# EAGLE design usteps_v4 (EAGLE 9.0.0)
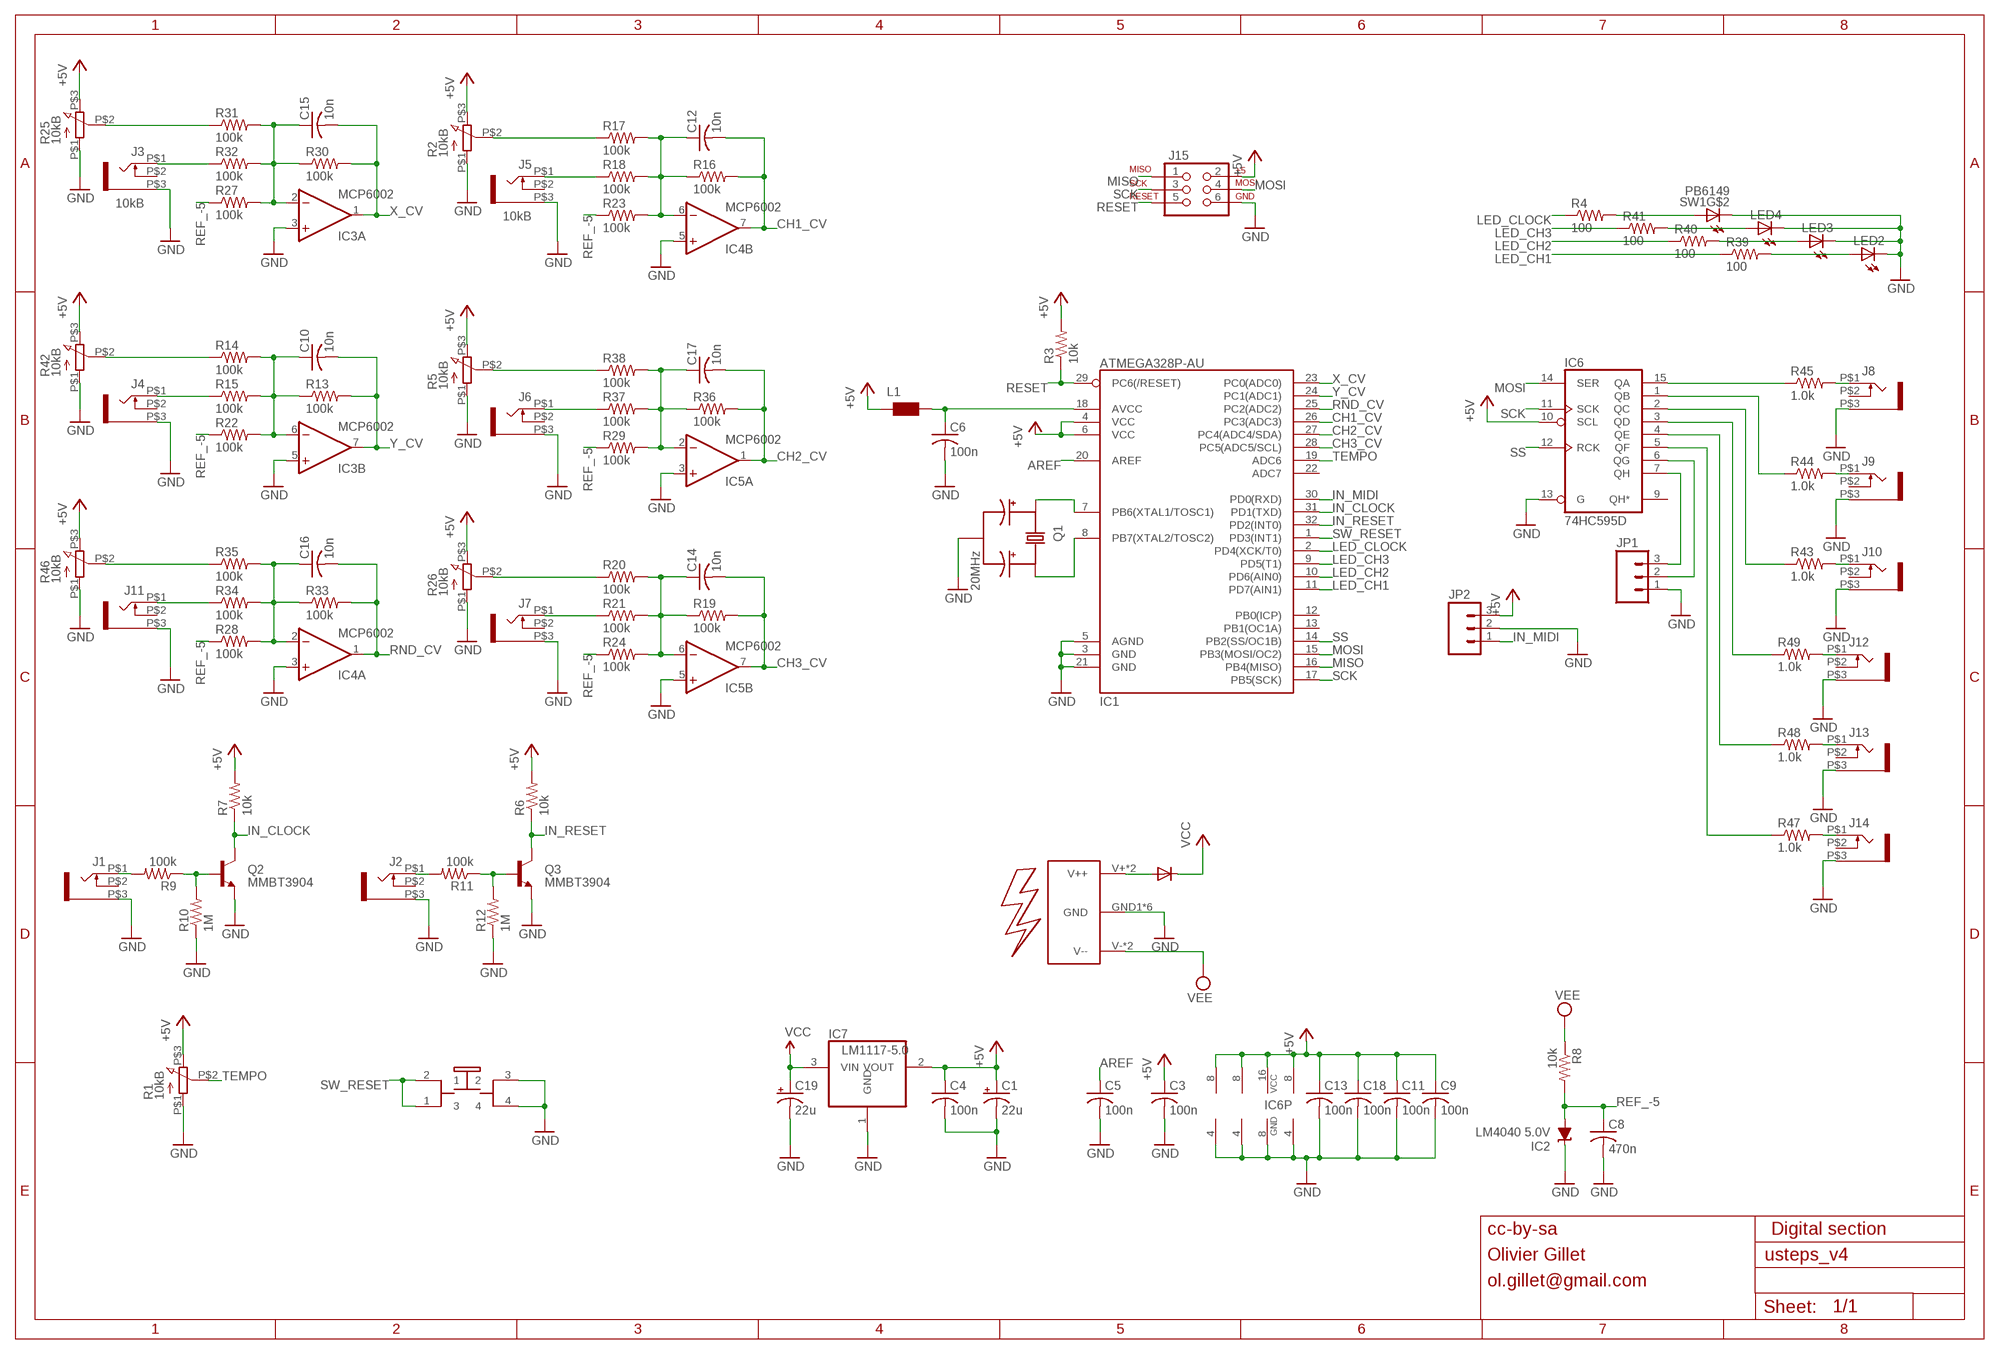
[diagram p0: schematic, sheet 1]

## Parts
C1  22u  CPOL-USC  [PANASONIC_C]
C3  100n  C-USC0603  [C0603]
C4  100n  C-USC0603  [C0603]
C5  100n  C-USC0603  [C0603]
C6  100n  C-USC0603  [C0603]
C8  470n  C-USC0603  [C0603]
C9  100n  C-USC0603  [C0603]
C10  10n  C-USC0603  [C0603]
C11  100n  C-USC0603  [C0603]
C12  10n  C-USC0603  [C0603]
C13  100n  C-USC0603  [C0603]
C14  10n  C-USC0603  [C0603]
C15  10n  C-USC0603  [C0603]
C16  10n  C-USC0603  [C0603]
C17  10n  C-USC0603  [C0603]
C18  100n  C-USC0603  [C0603]
C19  22u  CPOL-USC  [PANASONIC_C]
D2  1N5819HW  DIODE-SOD123  [SOD123]
IC1  ATMEGA328P-AU  ATMEGA168  [TQFP32-08]
IC2  LM4040 5.0V  LM4041C12DBZ  [DBZ_R-PDSO-G3]
IC3  MCP6002  TL072D  [SO08]
IC4  MCP6002  TL072D  [SO08]
IC5  MCP6002  TL072D  [SO08]
IC6  74HC595D  [SO16]
IC7  LM1117-5.0  REG1117  [SOT223]
J1  WQP-PJ301M-12_JACK  [WQP-PJ301M-12_JACK]
J2  WQP-PJ301M-12_JACK  [WQP-PJ301M-12_JACK]
J3  10kB  WQP-PJ301M-12_JACK  [WQP-PJ301M-12_JACK]
J4  WQP-PJ301M-12_JACK  [WQP-PJ301M-12_JACK]
J5  10kB  WQP-PJ301M-12_JACK  [WQP-PJ301M-12_JACK]
J6  WQP-PJ301M-12_JACK  [WQP-PJ301M-12_JACK]
J7  WQP-PJ301M-12_JACK  [WQP-PJ301M-12_JACK]
J8  WQP-PJ301M-12_JACK  [WQP-PJ301M-12_JACK]
J9  WQP-PJ301M-12_JACK  [WQP-PJ301M-12_JACK]
J10  WQP-PJ301M-12_JACK  [WQP-PJ301M-12_JACK]
J11  WQP-PJ301M-12_JACK  [WQP-PJ301M-12_JACK]
J12  WQP-PJ301M-12_JACK  [WQP-PJ301M-12_JACK]
J13  WQP-PJ301M-12_JACK  [WQP-PJ301M-12_JACK]
J14  WQP-PJ301M-12_JACK  [WQP-PJ301M-12_JACK]
J15  AVR_SPI_PRG_6PTH  [2X3]
JP1  M03PTH  [1X03]
JP2  M03PTH  [1X03]
L1  WE-CBF_0603  [0603]
LED2  LED3MM  [LED3MM]
LED3  LED3MM  [LED3MM]
LED4  LED3MM  [LED3MM]
Q1  20MHz  INSTRUO_CRYSTAL_SMALLER  [INSTRUO_CRYSTAL_SMALLER]
Q2  MMBT3904  MMBT3904LT1-NPN-SOT23-BEC  [SOT23-BEC]
Q3  MMBT3904  MMBT3904LT1-NPN-SOT23-BEC  [SOT23-BEC]
R1  10kB  INSTRUO_Q-POT2  [INSTRUO_Q-POT2]
R2  10kB  INSTRUO_Q-POT2  [INSTRUO_Q-POT2]
R3  10k  R-US_R0603  [R0603]
R4  100  R-US_R0603  [R0603]
R5  10kB  INSTRUO_Q-POT2  [INSTRUO_Q-POT2]
R6  10k  R-US_R0603  [R0603]
R7  10k  R-US_R0603  [R0603]
R8  10k  R-US_R0603  [R0603]
R9  100k  R-US_R0603  [R0603]
R10  1M  R-US_R0603  [R0603]
R11  100k  R-US_R0603  [R0603]
R12  1M  R-US_R0603  [R0603]
R13  100k  R-US_R0603  [R0603]
R14  100k  R-US_R0603  [R0603]
R15  100k  R-US_R0603  [R0603]
R16  100k  R-US_R0603  [R0603]
R17  100k  R-US_R0603  [R0603]
R18  100k  R-US_R0603  [R0603]
R19  100k  R-US_R0603  [R0603]
R20  100k  R-US_R0603  [R0603]
R21  100k  R-US_R0603  [R0603]
R22  100k  R-US_R0603  [R0603]
R23  100k  R-US_R0603  [R0603]
R24  100k  R-US_R0603  [R0603]
R25  10kB  INSTRUO_Q-POT2  [INSTRUO_Q-POT2]
R26  10kB  INSTRUO_Q-POT2  [INSTRUO_Q-POT2]
R27  100k  R-US_R0603  [R0603]
R28  100k  R-US_R0603  [R0603]
R29  100k  R-US_R0603  [R0603]
R30  100k  R-US_R0603  [R0603]
R31  100k  R-US_R0603  [R0603]
R32  100k  R-US_R0603  [R0603]
R33  100k  R-US_R0603  [R0603]
R34  100k  R-US_R0603  [R0603]
R35  100k  R-US_R0603  [R0603]
R36  100k  R-US_R0603  [R0603]
R37  100k  R-US_R0603  [R0603]
R38  100k  R-US_R0603  [R0603]
R39  100  R-US_R0603  [R0603]
R40  100  R-US_R0603  [R0603]
R41  100  R-US_R0603  [R0603]
R42  10kB  INSTRUO_Q-POT2  [INSTRUO_Q-POT2]
R43  1.0k  R-US_R0603  [R0603]
R44  1.0k  R-US_R0603  [R0603]
R45  1.0k  R-US_R0603  [R0603]
R46  10kB  INSTRUO_Q-POT2  [INSTRUO_Q-POT2]
R47  1.0k  R-US_R0603  [R0603]
R48  1.0k  R-US_R0603  [R0603]
R49  1.0k  R-US_R0603  [R0603]
SW1  PB6149  INSTRUO_PB6149_FIXED  [INSTRUO_PB6149L]
U$1  INSTRUO_EURO_POWER2  [INSTRUO_EURO_POWER2]

## Nets
+5V: C1.+ C3.1 C4.1 C9.1 C11.1 C13.1 C18.1 IC1.4(VCC) IC1.6(VCC) IC3.8(P:V+) IC4.8(P:V+) IC5.8(P:V+) IC6.10(SCL) IC6.16(VCC) IC7.2(VOUT) J15.2 JP2.3 L1.1 R1.P$3 R2.P$3 R3.2 R5.P$3 R6.2 R7.2 R25.P$3 R26.P$3 R42.P$3 R46.P$3
AREF: C5.1 IC1.20(AREF)
CH1_CV: C12.2 IC1.26(PC3(ADC3)) IC4.7(B:OUT) R16.2
CH2_CV: C17.2 IC1.27(PC4(ADC4/SDA)) IC5.1(A:OUT) R36.2
CH3_CV: C14.2 IC1.28(PC5(ADC5/SCL)) IC5.7(B:OUT) R19.2
CLOCK_OUT: IC6.6(QG) JP1.2
GATE1_IN: J1.P$1 R9.2
GATE1_LED: R4.2 SW1.A
GATE2_IN: J2.P$1 R11.2
GATE2_LED: LED4.A R41.2
GATE3_LED: LED3.A R40.2
GATE4_LED: LED2.A R39.2
GND: C1.- C3.2 C4.2 C5.2 C6.2 C8.2 C9.2 C11.2 C13.2 C18.2 C19.- IC1.3(GND) IC1.5(AGND) IC1.21(GND) IC2.1(C) IC3.3(A:+IN) IC3.4(P:V-) IC3.5(B:+IN) IC4.3(A:+IN) IC4.4(P:V-) IC4.5(B:+IN) IC5.3(A:+IN) IC5.4(P:V-) IC5.5(B:+IN) IC6.8(GND) IC6.13(G) IC7.1(GND) J1.P$3 J2.P$3 J3.P$3 J4.P$3 J5.P$3 J6.P$3 J7.P$3 J8.P$3 J9.P$3 J10.P$3 J11.P$3 J12.P$3 J13.P$3 J14.P$3 J15.6 JP1.1 JP2.2 LED2.K(C) LED3.K(C) LED4.K(C) Q1.GND Q2.E Q3.E R1.P$1 R2.P$1 R5.P$1 R10.1 R12.1 R25.P$1 R26.P$1 R42.P$1 R46.P$1 SW1.3 SW1.4 SW1.K(C) U$1.GND1(GND) U$1.GND2(GND) U$1.GND3(GND) U$1.GND4(GND) U$1.GND5(GND) U$1.GND6(GND)
IN_CLOCK: IC1.31(PD1(TXD)) Q2.C R7.1
IN_MIDI: IC1.30(PD0(RXD)) JP2.1
IN_RESET: IC1.32(PD2(INT0)) Q3.C R6.1
LED_CH1: IC1.11(PD7(AIN1)) R39.1
LED_CH2: IC1.10(PD6(AIN0)) R40.1
LED_CH3: IC1.9(PD5(T1)) R41.1
LED_CLOCK: IC1.2(PD4(XCK/T0)) R4.1
MISO: IC1.16(PB4(MISO)) J15.1
MOSI: IC1.15(PB3(MOSI/OC2)) IC6.14(SER) J15.4
N$1: Q2.B R9.1 R10.2
N$2: Q3.B R11.1 R12.2
N$3: IC1.7(PB6(XTAL1/TOSC1)) Q1.X1
N$4: J14.P$1 R47.2
N$5: J13.P$1 R48.2
N$6: J12.P$1 R49.2
N$7: IC1.8(PB7(XTAL2/TOSC2)) Q1.X2
N$8: D2.A U$1.V+(V++) U$1.V++
N$9: R25.P$2 R31.1
N$10: J3.P$1 R32.1
N$12: C10.1 IC3.6(B:-IN) R13.1 R14.2 R15.2 R22.2
N$13: R14.1 R42.P$2
N$14: J4.P$1 R15.1
N$15: C16.1 IC4.2(A:-IN) R28.2 R33.1 R34.2 R35.2
N$16: R35.1 R46.P$2
N$17: J11.P$1 R34.1
N$18: C12.1 IC4.6(B:-IN) R16.1 R17.2 R18.2 R23.2
N$19: R2.P$2 R17.1
N$20: J5.P$1 R18.1
N$21: C17.1 IC5.2(A:-IN) R29.2 R36.1 R37.2 R38.2
N$22: R5.P$2 R38.1
N$23: J6.P$1 R37.1
N$24: C14.1 IC5.6(B:-IN) R19.1 R20.2 R21.2 R24.2
N$25: R20.1 R26.P$2
N$26: J7.P$1 R21.1
N$27: IC6.15(QA) R45.1
N$28: IC6.1(QB) R44.1
N$29: C15.1 IC3.2(A:-IN) R27.2 R30.1 R31.2 R32.2
N$30: IC6.2(QC) R43.1
N$31: IC6.3(QD) R49.1
N$32: IC6.4(QE) R48.1
N$33: IC6.5(QF) R47.1
N$34: J8.P$1 R45.2
N$35: J9.P$1 R44.2
N$36: J10.P$1 R43.2
N$39: C6.1 IC1.18(AVCC) L1.2
RANDOM_GATE: IC6.7(QH) JP1.3
REF_-5: C8.1 IC2.2(A) R8.2 R22.1 R23.1 R24.1 R27.1 R28.1 R29.1
RESET: IC1.29(PC6(/RESET)) J15.5 R3.1
RND_CV: C16.2 IC1.25(PC2(ADC2)) IC4.1(A:OUT) R33.2
SCK: IC1.17(PB5(SCK)) IC6.11(SCK) J15.3
SS: IC1.14(PB2(SS/OC1B)) IC6.12(RCK)
SW_RESET: IC1.1(PD3(INT1)) SW1.1 SW1.2
TEMPO: IC1.19(ADC6) R1.P$2
VCC: C19.+ D2.C IC7.3(VIN)
VEE: R8.1 U$1.V-(V--) U$1.V--
X_CV: C15.2 IC1.23(PC0(ADC0)) IC3.1(A:OUT) R30.2
Y_CV: C10.2 IC1.24(PC1(ADC1)) IC3.7(B:OUT) R13.2
Unconnected: IC1.12(PB0(ICP)) IC1.13(PB1(OC1A)) IC1.22(ADC7) IC6.9(QH*) J1.P$2 J2.P$2 J3.P$2 J4.P$2 J5.P$2 J6.P$2 J7.P$2 J8.P$2 J9.P$2 J10.P$2 J11.P$2 J12.P$2 J13.P$2 J14.P$2

## Notes on the sheet
- cc-by-sa | Digital section
- Olivier Gillet
- ol.gillet@gmail.com

## Library data of the parts
C1 C19 = rcl:CPOL-US: POLARIZED CAPACITOR, American symbol
C3-C6 C8-C18 = rcl:C-US: CAPACITOR, American symbol
D2 = diode:DIODE-: DIODE
IC1 = SparkFun:ATMEGA168
IC2 = texas:LM4041: PRECISION MICROPOWER SHUNT VOLTAGE REFERENCE Source: http://focus.ti.com/lit/ds/slcs146e/slcs146e.pdf
IC3-IC5 = og-linear:TL072: OP AMP
IC6 = 74xx-eu:74*595: 8-bit SHIFT REGISTER, output latch
IC7 = og-vreg:REG1117: 800mA and 1A Low Dropout (LDO) Positive Regulator 1.8V, 2.5V, 2.85V, 3.3V, 5V, and Adj
J1-J14 = thonkiconn:WQP-PJ301M-12_JACK
J15 = SparkFun:AVR_SPI_PRG_6: AVR ISP 6 Pin This is the reduced ISP connector for AVR programming. Common on Arduino. This footprint will take up less PCB space and can be used with a 10-pin to 6-pin adapter such as SKU: BOB-08508
JP1 JP2 = SparkFun:M03: Header 3 Standard 3-pin 0.1" header. Use with straight break away headers (SKU : PRT-00116), right angle break away headers (PRT-00553), swiss pins (PRT-00743), machine pins (PRT-00117), and female headers (PRT-00115). Molex polarized connector foot print use with SKU : PRT-08232 with associated crimp pins and housings.
L1 = wuerth-elektronik:WE-CBF: SMD EMI Suppression Ferrite Beads - excellent anti-EMI properties - low DCR - impedances till 3000 ohms - rated current up to 6 A
LED2-LED4 = led:LED: LED OSRAM: - CHIPLED LG R971, LG N971, LY N971, LG Q971, LY Q971, LO R971, LY R971 LH N974, LH R974 LS Q976, LO Q976, LY Q976 LO Q996 - Hyper CHIPLED LW Q18S LB Q993, LB Q99A, LB R99A - SideLED LS A670, LO A670, LY A670, LG A670, LP A670 LB A673, LV A673, LT A673, LW A673 LH A674 LY A675 LS A676, LA A676, LO A676, LY A676, LW A676 LS A679, LY A679, LG A679 - Hyper Micro SIDELED® LS Y876, LA Y876, LO Y876, LY Y876 LT Y87S - SmartLED LW L88C, LW L88S LB L89C, LB L89S, LG L890 LS L89K, LO L89K, LY L89K LS L896, LA L896, LO L896, LY L896 - TOPLED LS T670, LO T670, LY T670, LG T670, LP T670 LSG T670, LSP T670, LSY T670, LOP T670, LYG T670 LG T671, LOG T671, LSG T671 LB T673, LV T673, LT T673, LW T673 LH T674 LS T676, LA T676, LO T676, LY T676, LB T676, LH T676, LSB T676, LW T676 LB T67C, LV T67C, LT T67C, LS T67K, LO T67K, LY T67K, LW E67C LS E67B, LA E67B, LO E67B, LY E67B, LB E67C, LV E67C, LT E67C LW T67C LS T679, LY T679, LG T679 LS T770, LO T770, LY T770, LG T770, LP T770 LB T773, LV T773, LT T773, LW T773 LH T774 LS E675, LA E675, LY E675, LS T675 LS T776, LA T776, LO T776, LY T776, LB T776 LHGB T686 LT T68C, LB T68C - Hyper Mini TOPLED® LB M676 - Mini TOPLED Santana® LG M470 LS M47K, LO M47K, LY M47K Source: http://www.osram.convergy.de LUXEON: - LUMILED® LXK2-PW12-R00, LXK2-PW12-S00, LXK2-PW14-U00, LXK2-PW14-V00 LXK2-PM12-R00, LXK2-PM12-S00, LXK2-PM14-U00 LXK2-PE12-Q00, LXK2-PE12-R00, LXK2-PE12-S00, LXK2-PE14-T00, LXK2-PE14-U00 LXK2-PB12-K00, LXK2-PB12-L00, LXK2-PB12-M00, LXK2-PB14-N00, LXK2-PB14-P00, LXK2-PB14-Q00 LXK2-PR12-L00, LXK2-PR12-M00, LXK2-PR14-Q00, LXK2-PR14-R00 LXK2-PD12-Q00, LXK2-PD12-R00, LXK2-PD12-S00 LXK2-PH12-R00, LXK2-PH12-S00 LXK2-PL12-P00, LXK2-PL12-Q00, LXK2-PL12-R00 Source: www.luxeon.com KINGBRIGHT: KA-3528ASYC Source: www.kingbright.com
Q1 = uClouds_002_:INSTRUO_CRYSTAL_SMALLER: CSTCE16M0V53-R0
Q2 Q3 = transistor:*-NPN-: NPN Transistror BF959 corrected 2008.03.06
R1 R2 R5 R25 R26 R42 R46 = uClouds_002_:INSTRUO_Q-POT2
R3 R4 R6 R7 R9-R24 R27-R41 R43-R45 R47-R49 = rcl:R-US_: RESISTOR, American symbol
R8 = resistor:R-US_: RESISTOR, American symbol
SW1 = uClouds_002_:INSTRUO_PB6149_FIXED
U$1 = uClouds_002_:INSTRUO_EURO_POWER2

## Board
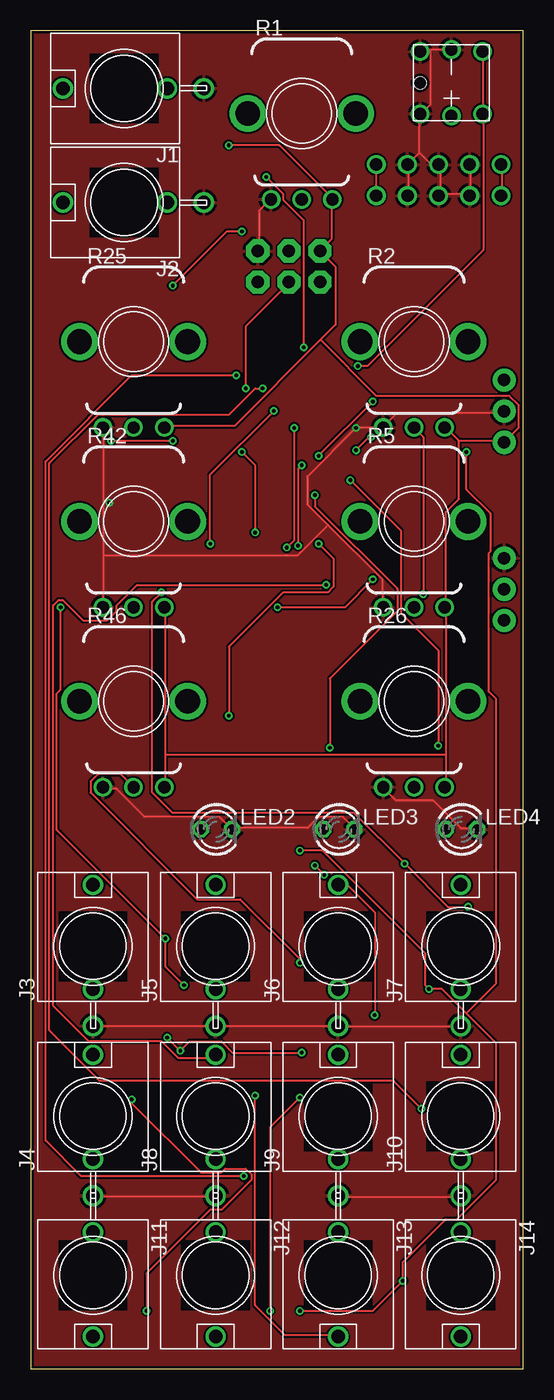
[diagram p1: board, top side]
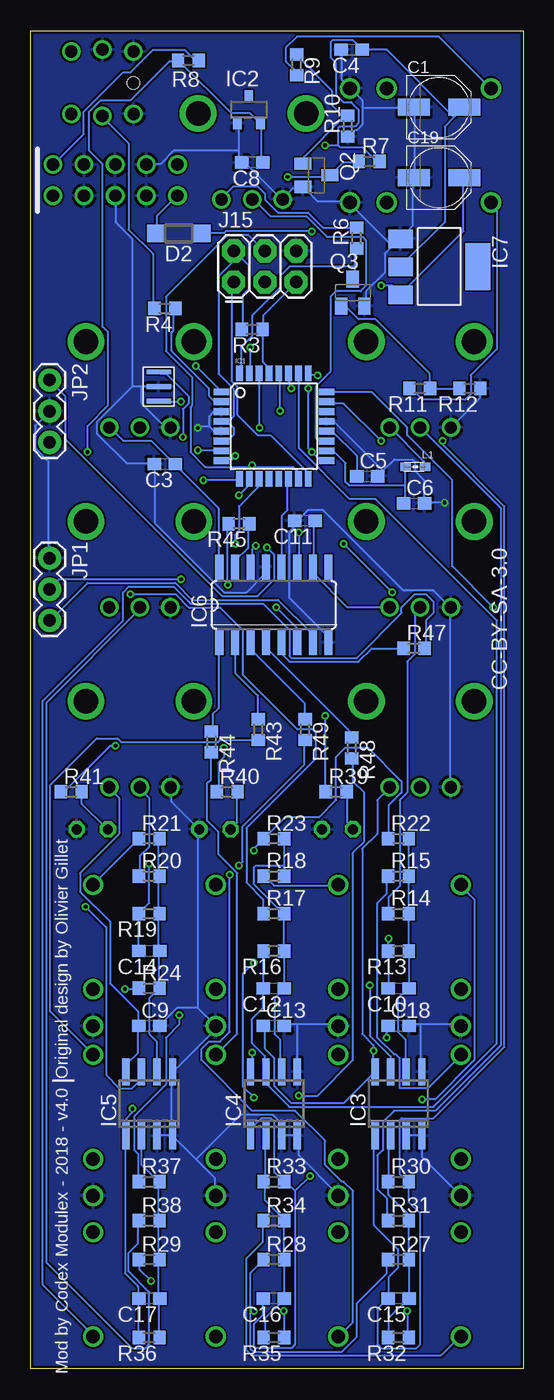
[diagram p2: board, bottom side, seen from below]

Size 40.14 x 109 mm. Coordinates in mm from the lower left corner, seen from the top.
Outline: 0,0 40.14,0 40.14,109 0,109 0,0
Copper layers (1*16): Top 0.035mm / dielectric 1.5mm / Bottom 0.035mm
Design rules "dirt_cheap_dirty_boards.v1.1": minimum track width 6mil, minimum drill 12mil, track to track 6mil, track to pad 6mil, pad to pad 6mil, via to via 6mil, smd to smd 0mil, copper to edge 10mil, drill to drill 10mil, minimum pad ring 10mil, minimum via ring 6mil, stop-mask expansion 2mil, vias tented up to drill 25mil, thermal gap 10mil

### Footprints (pad centres in the part's own frame; a part is rotated, then mirrored left to right if it is on the bottom)
PANASONIC_C = smd 2.6 x 1.4: + 2.05,0; - -2.05,0
C0603 = smd 1.1 x 1: 1 -0.85,0; 2 0.85,0
SOD123 = smd 1.4 x 1.4: A 1.9,0; C -1.9,0
TQFP32-08 = smd 1.27 x 0.559: 1 -4.293,2.8; 2 -4.293,2; 3 -4.293,1.2; 4 -4.293,0.4; 5 -4.293,-0.4; 6 -4.293,-1.2; 7 -4.293,-2; 8 -4.293,-2.8; 17 4.293,-2.8; 18 4.293,-2; 19 4.293,-1.2; 20 4.293,-0.4; 21 4.293,0.4; 22 4.293,1.2; 23 4.293,2; 24 4.293,2.8 | smd 0.559 x 1.27: 9 -2.8,-4.293; 10 -2,-4.293; 11 -1.2,-4.293; 12 -0.4,-4.293; 13 0.4,-4.293; 14 1.2,-4.293; 15 2,-4.293; 16 2.8,-4.293; 25 2.8,4.293; 26 2,4.293; 27 1.2,4.293; 28 0.4,4.293; 29 -0.4,4.293; 30 -1.2,4.293; 31 -2,4.293; 32 -2.8,4.293
DBZ_R-PDSO-G3 = smd 0.7 x 1: 1 -0.95,-1.1; 2 0.95,-1.1; 3 0,1.1
SO08 = smd 0.6 x 2.2: 1 -1.905,-2.6; 2 -0.635,-2.6; 3 0.635,-2.6; 4 1.905,-2.6; 5 1.905,2.6; 6 0.635,2.6; 7 -0.635,2.6; 8 -1.905,2.6
SO16 = smd 0.66 x 2.032: 1 -4.445,-3.073; 2 -3.175,-3.073; 3 -1.905,-3.073; 4 -0.635,-3.073; 5 0.635,-3.073; 6 1.905,-3.073; 7 3.175,-3.073; 8 4.445,-3.073; 9 4.445,3.073; 10 3.175,3.073; 11 1.905,3.073; 12 0.635,3.073; 13 -0.635,3.073; 14 -1.905,3.073; 15 -3.175,3.073; 16 -4.445,3.073
SOT223 = smd 1.499 x 2.007: 1 -2.261,-3.15; 2 0.025,-3.15; 3 2.311,-3.15 | smd 3.81 x 2.007: 4 0,3.15
WQP-PJ301M-12_JACK = drill 1.1: P$1 0,5; P$2 0,-3.5; P$3 0,-6.5
2X3 = drill 1.016 pad 1.88 octagon: 1 0,0; 2 0,2.54; 3 2.54,0; 4 2.54,2.54; 5 5.08,0; 6 5.08,2.54
1X03 = drill 1.016 pad 1.88: 1 0,0; 2 2.54,0; 3 5.08,0
0603 = smd 0.85 x 0.7: 1 -0.9,0; 2 0.7,0
LED3MM = drill 0.813 octagon: A -1.27,0; K 1.27,0
INSTRUO_CRYSTAL_SMALLER = smd 0.4 x 2: GND 0,0; X1 -1.2,0; X2 1.2,0
SOT23-BEC = smd 1 x 1.4: B -0.95,-1.1; C 0,1.1; E 0.95,-1.1
INSTRUO_Q-POT2 = drill 1 pad 1.5: P$1 -2.5,-7; P$2 0,-7; P$3 2.5,-7 | drill 2 pad 2.5: P$4 -4.4,0; P$5 4.4,0
R0603 = smd 1 x 1.1: 1 -0.85,0; 2 0.85,0
INSTRUO_PB6149L = drill 1: 1 2.54,-2.54; 2 2.54,2.54; 3 -2.54,-2.54; 4 -2.54,2.54; A 0,-2.7; K 0,2.7 | hole 1: -2.54,0
INSTRUO_EURO_POWER2 = drill 1.016: GND1 -1.27,2.54; GND2 1.27,2.54; GND3 -1.27,0; GND4 1.27,0; GND5 -1.27,-2.54; GND6 1.27,-2.54; V+ -1.27,5.08; V++ 1.27,5.08; V- -1.27,-5.08; V-- 1.27,-5.08

### Placement (x,y rotation side)
C1  6.86,102.76 0 bottom
C3  29.21,73.7 180 bottom
C4  13.97,107.45 180 bottom
C5  12.7,72.7 0 bottom
C6  8.89,70.51 0 bottom
C8  22.09,98.26 180 bottom
C9  30.48,27.94 0 bottom
C10  10.16,30.99 180 bottom
C11  17.78,69.08 180 bottom
C12  20.32,30.99 180 bottom
C13  20.32,27.94 0 bottom
C14  30.48,34.04 180 bottom
C15  10.16,5.71 180 bottom
C16  20.32,5.71 180 bottom
C17  30.48,5.71 180 bottom
C18  10.16,27.94 0 bottom
C19  6.86,97.04 0 bottom
D2  28.07,92.49 180 bottom
IC1  20.32,76.78 0 bottom
IC2  22.36,102.57 0 bottom
IC3  10.16,21.59 0 bottom
IC4  20.32,21.59 0 bottom
IC5  30.48,21.59 0 bottom
IC6  20.32,62.23 0 bottom
IC7  6.85,89.79 270 bottom
J1  7.62,104.3 90 top
J2  7.62,95 90 top
J3  5.08,34.42 0 top
J4  5.08,20.57 0 top
J5  15.07,34.42 0 top
J6  25.06,34.42 0 top
J7  35.05,34.42 0 top
J8  15.07,20.57 0 top
J9  25.06,20.57 0 top
J10  35.05,20.57 0 top
J11  5.08,7.62 180 top
J12  15.07,7.62 180 top
J13  25.06,7.62 180 top
J14  35.05,7.62 180 top
J15  23.59,88.52 0 bottom
JP1  38.6,66.04 270 bottom
JP2  38.6,80.55 270 bottom
L1  8.89,73.47 180 bottom
LED2  15.13,43.95 0 top
LED3  25.12,43.95 0 top
LED4  35.12,43.95 0 top
Q1  29.71,80.01 270 bottom
Q2  16.86,97.22 270 bottom
Q3  13.89,87.67 0 bottom
R1  22.09,102.26 0 top
R2  31.24,83.67 0 top
R3  22.09,84.67 180 bottom
R4  29.21,86.36 180 bottom
R5  31.24,69.03 0 top
R6  13.58,92.11 90 bottom
R7  12.54,98.34 0 bottom
R8  27.28,106.57 180 bottom
R9  18.47,106.22 270 bottom
R10  14.29,101.22 90 bottom
R11  8.43,79.86 180 bottom
R12  4.35,79.86 180 bottom
R13  10.16,34.04 180 bottom
R14  10.16,37.08 0 bottom
R15  10.16,40.13 0 bottom
R16  20.32,34.04 180 bottom
R17  20.32,37.08 0 bottom
R18  20.32,40.13 0 bottom
R19  30.48,37.08 180 bottom
R20  30.48,40.13 0 bottom
R21  30.48,43.18 0 bottom
R22  10.16,43.18 0 bottom
R23  20.32,43.18 0 bottom
R24  30.48,30.99 0 bottom
R25  8.39,83.67 0 top
R26  31.24,54.38 0 top
R27  10.16,8.89 0 bottom
R28  20.32,8.89 0 bottom
R29  30.48,8.89 0 bottom
R30  10.16,15.24 0 bottom
R31  10.16,12.06 0 bottom
R32  10.16,2.54 180 bottom
R33  20.32,15.24 0 bottom
R34  20.32,12.06 0 bottom
R35  20.32,2.54 180 bottom
R36  30.48,2.54 180 bottom
R37  30.48,15.24 0 bottom
R38  30.48,12.06 0 bottom
R39  15.24,46.99 0 bottom
R40  24.13,46.99 0 bottom
R41  36.83,46.99 0 bottom
R42  8.39,69.03 0 top
R43  21.59,52.07 270 bottom
R44  25.4,51.07 270 bottom
R45  23.17,68.85 180 bottom
R46  8.39,54.38 0 top
R47  8.89,58.69 0 bottom
R48  13.97,50.57 270 bottom
R49  17.78,52.07 270 bottom
SW1  34.29,104.76 0 top
U$1  33.25,96.83 270 bottom

### Tracks (layer width: path | path; a pad name or v marks a point on that pad's centre or on a via)
+5V  (via drill 0.3)
  Top 0.152: v11.12,26.98 v12.19,25.91 12.95,26.67 15.54,26.67 16.46,25.76 v22.1,25.76 | 10.97,49.99 10.97,61.87 R42.P$3 | 10.97,49.99 10.97,47.4 R46.P$3 | 23.62,83.82 24.84,85.04 24.84,89.76 23.62,90.98 J15.2 23.62,91.14 24.54,92.05 24.54,95.25 R1.P$3 24.54,95.4 20.27,99.67 v16.15,99.67 | 23.62,83.82 16.61,76.81 10.97,76.81 R25.P$3 | 34.9,75.59 38.56,75.59 JP2.3 38.71,75.59 39.78,76.66 39.78,78.49 39.01,79.25 28.19,79.25 23.62,83.82 | 34.9,75.59 33.83,76.66 R2.P$3 | 33.83,49.99 33.83,61.87 R5.P$3 33.83,62.03 33.83,69.8 34.9,70.87 34.9,75.59 | 33.83,49.99 33.83,47.4 R26.P$3 | 33.83,49.99 10.97,49.99
  Bottom 0.152: v11.12,26.98 11.12,27.89 C18.1 | C13.1 21.03,27.89 21.03,26.06 20.27,25.3 20.27,23.01 18.9,21.64 14.63,21.64 12.19,24.08 IC3.8 12.19,24.23 v12.19,25.91 12.19,26.36 13.11,27.28 13.11,42.37 11.89,43.59 11.89,46.33 10.97,47.24 R46.P$3 | v22.1,25.76 22.1,24.23 IC4.8 | C11.1 17.07,69.04 17.07,65.38 IC6.10 17.07,65.23 17.07,64.77 14.33,62.03 10.97,62.03 R42.P$3 | 15.09,99.67 14.94,99.52 13.11,99.52 12.04,98.45 11.73,98.45 R7.2 | 15.09,99.67 15.09,101.04 14.94,101.19 13.72,101.19 13.41,101.5 13.41,102.56 14.02,103.17 14.63,103.17 15.24,103.78 15.24,106.38 15.7,106.83 15.7,108.05 15.54,108.2 13.87,108.2 13.26,107.59 C4.1 13.11,107.44 11.12,107.44 5.64,101.96 | 5.64,101.96 4.88,102.72 C1.+ | 5.64,101.96 6.4,101.19 6.4,93.42 9.91,89.92 IC7.2 | R6.2 13.72,92.96 16.31,92.96 17.53,94.18 19.96,94.18 21.03,95.25 21.03,95.71 21.64,96.32 23.62,96.32 24.54,95.4 R1.P$3 | L1.1 8.08,73.61 8.08,73.91 10.82,76.66 R25.P$3 | 24.08,77.11 23.62,76.66 23.62,76.05 24.08,75.59 24.54,75.59 IC1.6 | 24.08,77.11 24.54,77.11 IC1.4 24.08,77.11 | 23.16,90.68 23.47,90.98 J15.2 23.16,90.68 | 23.16,90.68 22.4,89.92 22.4,87.94 22.86,87.48 22.86,84.73 R3.2 | 24.08,77.11 23.62,77.57 23.62,79.86 24.84,81.08 24.84,89 23.16,90.68 | v16.15,99.67 15.09,99.67 | R2.P$3 33.68,76.66 32.61,75.59 30.33,75.59 28.5,73.76 C3.1 28.35,73.61 24.84,70.1 24.84,65.38 IC6.16 | IC5.8 32.31,24.23 32.31,24.84 31.39,25.76 31.39,27.89 C9.1 31.39,28.04 31.39,29.11 33.68,31.39 33.68,36.42 36.12,38.86 36.12,40.39 32.92,43.59 32.92,46.48 33.68,47.24 R26.P$3
AREF
  Bottom 0.152: C5.1 13.56,72.85 13.56,74.37 15.54,76.35 16,76.35 IC1.20
CH1_CV
  Bottom 0.152: R16.2 21.18,33.98 21.18,31.09 C12.2 21.18,30.94 21.18,29.41 22.1,28.5 22.1,26.52 21.03,25.45 21.03,24.23 IC4.7 20.88,24.08 20.88,23.16 19.05,21.34 7.32,21.34 2.13,26.52 2.13,60.96 12.04,70.87 14.17,70.87 18.29,74.98 18.29,80.92 IC1.26
CH2_CV  (via drill 0.3)
  Top 0.152: v18.9,79.86 18.29,79.86 16.15,77.72 5.49,77.72 1.52,73.76 1.52,27.58 5.64,23.47 29.57,23.47 v31.85,21.18
  Bottom 0.152: R36.2 31.39,2.59 31.39,5.64 C17.2 31.39,5.79 31.39,6.71 32.46,7.77 32.46,18.9 IC5.1 32.31,19.05 32.31,20.42 31.85,20.88 v31.85,21.18 | v18.9,79.86 19.05,80.01 19.05,80.92 IC1.27
CH3_CV  (via drill 0.3)
  Top 0.152: v19.81,78.03 14.63,72.85 v14.63,67.21 | v10.67,63.25 9.91,62.48 9.91,46.94 11.58,45.26 26.36,45.26 v30.48,41.15 33.98,37.64 v35.66,37.64
  Bottom 0.152: C14.2 31.39,34.14 31.39,37.03 R19.2 31.24,37.19 30.48,37.95 v30.48,41.15 | v19.81,78.03 19.81,80.92 IC1.28 | v10.67,63.25 v14.63,67.21 | v35.66,37.64 33.98,35.97 33.98,23.93 32.92,22.86 31.85,22.86 31.24,23.47 31.24,24.08 IC5.7
CLOCK_OUT  (via drill 0.3)
  Top 0.152: v20.12,62.03 25.6,62.03 v27.89,64.31
  Bottom 0.152: v20.12,62.03 18.44,60.35 18.44,59.28 IC6.6 | v27.89,64.31 37.8,64.31 38.56,63.55 JP1.2
GATE1_IN
  Bottom 0.152: R9.2 18.59,105.46 18.59,105.77 19.36,106.53 19.36,107.59 18.44,108.51 6.86,108.51 2.74,104.39 J1.P$1
GATE1_LED
  Bottom 0.152: R4.2 30.18,86.41 30.18,90.83 32.16,92.81 32.16,99.82 34.29,101.96 SW1.A
GATE2_IN
  Bottom 0.152: R11.2 9.14,79.86 8.23,78.94 4.72,78.94 4.27,79.4 4.27,80.92 2.13,83.06 2.13,94.49 2.59,94.94 J2.P$1
GATE2_LED
  Bottom 0.152: R41.2 35.97,46.94 35.97,46.02 33.98,44.04 LED4.A
GATE3_LED
  Bottom 0.152: R40.2 23.32,46.94 23.32,44.5 23.77,44.04 LED3.A
GATE4_LED
  Bottom 0.152: R39.2 14.33,46.94 14.33,44.5 13.87,44.04 LED2.A
GND  (via drill 0.3)
  Top 0.152: 24.23,68.73 22.55,70.41 22.55,72.69 v26.52,76.66 28.65,76.66 R2.P$1 28.8,76.81 29.87,77.88 38.56,77.88 JP2.2 | 24.23,68.73 28.65,64.31 28.65,62.03 R5.P$1 | 32.61,107.44 34.29,107.44 SW1.K | 32.61,107.44 31.85,107.44 SW1.4 | U$1.GND5 35.81,97.99 35.81,95.71 U$1.GND6 35.66,95.71 33.38,95.71 | 33.38,95.71 33.38,97.99 U$1.GND3 33.22,98.15 32.61,98.15 31.7,99.06 | 31.7,99.06 31.7,102.11 SW1.3 31.85,102.26 32.61,103.02 32.61,107.44 | 31.7,99.06 30.79,98.15 U$1.GND1 30.79,97.99 30.79,95.71 U$1.GND2 | 33.38,95.71 U$1.GND4 | J15.6 18.59,91.14 18.59,94.34 19.51,95.25 R1.P$1 | J11.P$3 5.03,14.02 J4.P$3 5.18,14.02 14.94,14.02 J8.P$3 15.09,14.02 J12.P$3 | J3.P$3 5.18,27.89 14.94,27.89 J5.P$3 15.09,27.89 24.99,27.89 J6.P$3 25.15,27.89 34.9,27.89 J7.P$3 | 35.05,14.02 J10.P$3 | J10.P$3 J14.P$3 | 25.15,14.02 J13.P$3 | 25.15,14.02 34.9,14.02 J10.P$3 | 25.15,14.02 J9.P$3 | LED4.K 36.27,44.04 35.05,44.04 32.77,46.33 29.72,46.33 28.8,47.24 R26.P$1 | LED3.K 26.36,44.04 25.45,44.96 23.47,44.96 22.55,44.04 16.46,44.04 LED2.K 16.31,44.04 15.39,44.96 9.3,44.96 7.01,47.24 5.94,47.24 R46.P$1 | 5.94,66.29 5.94,62.03 R42.P$1 | 5.94,66.29 5.94,70.56 | 5.94,70.56 5.94,76.66 R25.P$1 | 5.94,70.56 v6.4,70.56 | 24.23,68.73 21.79,66.29 5.94,66.29
  Bottom 0.152: 31.85,80.01 34.75,77.11 34.75,76.2 32.31,73.76 30.18,73.76 C3.2 30.02,73.61 30.02,68.89 24.38,63.25 22.55,63.25 21.03,64.77 21.03,65.23 IC6.13 | Q1.GND 31.09,80.01 | 31.09,80.01 31.85,80.01 | JP1.1 38.71,66.14 38.71,73.91 39.78,74.98 39.78,76.81 38.71,77.88 JP2.2 | 25.6,76.81 25.3,76.5 24.69,76.5 IC1.5 | 25.6,76.81 25.6,77.57 25.3,77.88 24.69,77.88 IC1.3 | 25.6,76.81 26.36,76.81 v26.52,76.66 | 31.09,80.01 31.09,78.64 29.26,76.81 28.8,76.81 R2.P$1 | 13.11,102.72 13.11,103.33 14.02,104.24 J1.P$3 14.17,104.39 14.78,105 14.78,107.44 C4.2 | 13.11,102.72 13.11,101.35 13.56,100.89 13.72,100.89 14.17,100.43 R10.1 | 13.11,102.72 8.99,102.72 C1.- 8.84,102.72 8.84,97.08 C19.- 8.99,96.93 8.99,93.12 9.91,92.2 IC7.1 | 10.67,91.44 10.06,92.05 IC7.1 | 10.67,91.44 11.28,90.83 11.28,89.31 12.8,87.78 12.8,86.72 Q3.E | 23.16,99.21 23.16,98.45 23.01,98.3 C8.2 22.86,98.15 22.55,98.15 19.66,95.25 R1.P$1 19.51,95.4 18.75,96.16 17.98,96.16 Q2.E 17.83,96.16 16.76,95.1 14.17,95.1 J2.P$3 14.17,94.94 10.67,91.44 | 23.16,99.21 23.16,101.35 IC2.1 | 23.16,99.21 28.5,99.21 29.57,98.15 30.63,98.15 U$1.GND1 | 10.67,91.44 IC7.1 | 31.85,80.01 31.85,92.05 33.22,93.42 33.22,95.56 U$1.GND4 | IC3.3 9.45,19.05 8.38,19.05 IC3.4 8.23,18.9 8.23,17.22 5.18,14.17 J11.P$3 | J12.P$3 15.09,14.17 18.29,17.37 18.29,18.9 IC4.4 18.44,19.05 19.66,19.05 IC4.3 19.81,19.05 19.81,20.12 20.42,20.73 23.01,20.73 26.67,17.07 | 8.38,28.04 5.18,28.04 J3.P$3 | 8.38,28.04 9.3,28.04 C18.2 | 8.38,28.04 8.38,24.23 IC3.5 | 18.44,28.04 15.09,28.04 J5.P$3 | 18.44,28.04 19.36,28.04 C13.2 | 18.44,28.04 18.44,24.23 IC4.5 | 26.52,29.41 28.19,29.41 29.57,28.04 C9.2
  Bottom 0.152: 26.52,29.41 25.15,28.04 J6.P$3 25.15,27.89 25.15,27.58 28.5,24.23 IC5.5 28.65,24.08 28.65,19.05 | 28.65,19.05 29.72,19.05 IC5.3 | 28.65,19.05 IC5.4 28.5,18.9 26.67,17.07 | 26.67,17.07 25.15,15.54 25.15,14.17 J9.P$3 | 11.43,73.15 11.73,72.85 C5.2 11.43,73.15 | 11.43,73.15 10.52,74.07 8.99,74.07 8.84,73.91 8.84,73.15 8.08,72.39 8.08,70.56 C6.2 7.92,70.56 v6.4,70.56 | 11.43,73.15 15.39,77.11 16,77.11 IC1.21 | IC6.8 16,59.28 16,59.74 19.05,62.79 19.05,68.12 18.75,68.43 18.75,69.04 C11.2 18.59,69.19 18.29,69.19 17.53,69.95 16.31,69.95 9.75,63.4 7.32,63.4 5.94,62.03 R42.P$1 5.94,61.87 5.94,47.4 R46.P$1 | R12.1 3.5,79.1 5.79,76.81 R25.P$1 | R26.P$1 28.65,47.24 28.65,46.18 26.52,44.04 LED3.K 26.52,43.89 26.52,29.41
  pour Top (isolate 0.012): 0,109 40,109 40,0 0,0
  pour Bottom (isolate 0.012): 0,109 40,109 40,0 0,0
IN_CLOCK  (via drill 0.3)
  Top 0.152: v22.25,83.21 22.25,93.57 20.57,95.25 20.57,95.71 v19.2,97.08
  Bottom 0.152: R7.1 13.41,98.3 14.63,98.3 15.7,97.23 Q2.C 15.85,97.08 v19.2,97.08 | v22.25,83.21 22.25,81.08 IC1.31
IN_MIDI  (via drill 0.3)
  Top 0.152: v21.49,76.66 21.49,67.51 v20.88,66.9
  Bottom 0.152: v21.49,76.66 21.49,80.92 IC1.30 | v20.88,66.9 20.27,66.29 20.27,64.31 21.64,62.94 24.54,62.94 37.34,75.74 37.34,79.25 38.56,80.47 JP2.1
IN_RESET
  Bottom 0.152: 13.72,89.76 13.72,89 13.87,88.85 Q3.C | 13.72,89.76 13.72,91.14 R6.1 | 13.72,89.76 19.05,89.76 19.81,89 19.81,88.09 22.1,85.8 22.1,84.12 23.01,83.21 23.01,81.08 IC1.32
LED_CH1  (via drill 0.3)
  Top 0.152: v16.15,53.19 16.15,58.83 20.57,63.25 24.23,63.25 24.69,63.7 24.69,65.99 v23.47,67.21
  Bottom 0.152: v16.15,53.19 16.15,47.09 R39.1 | v23.47,67.21 23.47,67.97 23.16,68.28 23.16,70.26 21.64,71.78 21.64,72.39 IC1.11
LED_CH2  (via drill 0.3)
  Top 0.152: v24.38,50.6 24.38,56.24 29.87,61.72 29.87,63.55 23.16,70.26 v23.16,71.17
  Bottom 0.152: v24.38,50.6 24.38,49.84 24.84,49.38 24.84,47.09 R40.1 | v23.16,71.17 22.4,71.93 22.4,72.39 IC1.10
LED_CH3  (via drill 0.3)
  Top 0.152: v33.22,50.75 33.22,58.52 30.18,61.57 30.18,68.28 v26.06,72.39
  Bottom 0.152: v33.22,50.75 33.68,50.75 37.34,47.09 37.64,47.09 R41.1 | v26.06,72.39 23.16,72.39 IC1.9
LED_CLOCK
  Bottom 0.152: R4.1 28.5,86.26 28.5,84.58 28.65,84.43 28.65,82.91 25.6,79.86 25.6,79.25 25.15,78.79 24.69,78.79 IC1.2
MISO
  Bottom 0.152: IC1.16 17.53,72.54 17.53,73 20.57,76.05 21.64,76.05 23.32,77.72 23.32,80.01 23.77,80.47 23.77,88.24 23.62,88.39 J15.1
MOSI  (via drill 0.3)
  Top 0.152: v21.79,67.06 21.79,73.3 v22.1,73.61
  Bottom 0.152: 22.1,73.46 25.91,73.46 27.13,74.68 27.13,78.33 26.98,78.49 26.98,80.77 29.11,82.91 29.11,87.33 24.08,92.35 22.4,92.35 21.18,91.14 J15.4 | 22.1,73.46 18.75,73.46 18.44,73.15 18.44,72.54 IC1.15 | v21.79,67.06 22.1,66.75 22.1,65.38 IC6.14 | 22.1,73.46 v22.1,73.61
N$1
  Bottom 0.152: 14.63,101.96 14.33,101.96 R10.2 14.63,101.96 | 14.63,101.96 17.83,98.75 17.83,98.3 Q2.B | 14.63,101.96 15.54,102.87 15.54,104.09 18.44,106.98 R9.1
N$2
  Bottom 0.152: R12.2 5.33,79.86 7.47,79.86 R11.1 7.62,80.01 7.62,81.08 12.04,85.5 13.41,85.5 14.48,86.56 14.78,86.56 Q3.B
N$3  (via drill 0.3)
  Top 0.152: v26.52,74.83 27.58,75.89 v27.74,75.89
  Bottom 0.152: v26.52,74.83 24.69,74.83 IC1.7 | v27.74,75.89 27.74,78.18 27.28,78.64 27.28,79.25 29.11,81.08 29.57,81.08 Q1.X1
N$4
  Bottom 0.152: R47.2 7.92,58.83 7.92,60.96 7.32,61.57 7.32,62.48 7.92,63.09 8.84,63.09 9.91,62.03 9.91,61.57 13.56,57.91 18.9,57.91 19.05,58.06 19.05,60.2 21.18,62.33 27.13,62.33 28.5,63.7 32.16,63.7 32.61,63.25 32.61,60.96 39.17,54.41 39.17,6.86 35.05,2.74 J14.P$1
N$5  (via drill 0.3)
  Top 0.152: v18.29,22.25 18.29,5.18 20.73,2.74 24.99,2.74 J13.P$1
  Bottom 0.152: v18.29,22.25 16.76,22.25 13.87,25.15 13.87,42.06 12.95,42.98 12.95,46.94 13.87,47.85 13.87,49.68 R48.2
N$6  (via drill 0.3)
  Top 0.152: v23.93,40.23 v23.16,41
  Bottom 0.152: v23.16,41 22.86,41.3 22.86,44.2 17.83,49.23 17.83,51.21 R49.2 | v23.93,40.23 23.93,27.43 24.69,26.67 25.6,26.67 26.21,26.06 26.21,25.15 22.1,21.03 18.59,21.03 16.15,18.59 16.15,16.61 14.78,15.24 14.63,15.24 13.87,14.48 13.87,3.81 14.94,2.74 J12.P$1
N$7  (via drill 0.3)
  Top 0.152: v27.89,78.79 v23.47,74.37
  Bottom 0.152: v23.47,74.37 23.77,74.07 24.54,74.07 IC1.8 | v27.89,78.79 29.57,78.79 Q1.X2
N$8
  Top 0.152: U$1.V+ 28.19,97.99 28.19,95.71 U$1.V++
  Bottom 0.152: D2.A 29.87,92.51 29.87,93.88 28.19,95.56 U$1.V++
N$9
  Bottom 0.152: R31.1 11.12,12.19 11.12,13.87 11.89,14.63 11.89,17.37 11.43,17.83 11.43,20.12 10.52,21.03 7.16,21.03 1.83,26.36 1.83,70.1 8.38,76.66 R25.P$2
N$10  (via drill 0.3)
  Top 0.152: v9.45,4.72 9.45,7.77 14.63,12.95 15.54,12.95 17.98,15.39 17.98,15.85 17.53,16.31 15.85,16.31 15.54,16 13.87,16 8.23,21.64 v8.23,21.95
  Bottom 0.152: v9.45,4.72 9.45,2.59 R32.1 | v8.23,21.95 7.16,21.95 3.96,25.15 3.96,38.25 5.03,39.32 J3.P$1
N$12
  Bottom 0.152: R22.2 9.3,43.13 9.3,40.23 R15.2 9.3,40.08 9.3,37.19 R14.2 9.3,37.03 9.3,34.14 R13.1 9.3,33.98 9.3,31.09 C10.1 9.45,30.94 10.21,30.18 10.21,27.43 9.6,26.82 9.6,24.23 IC3.6
N$13
  Bottom 0.152: R14.1 10.97,37.19 10.97,38.41 10.06,39.32 10.06,46.33 9.45,46.94 9.45,57.61 8.84,58.22 8.84,61.57 8.53,61.87 R42.P$2
N$14
  Bottom 0.152: R15.1 11.12,40.08 11.12,38.71 11.89,37.95 11.89,26.98 10.52,25.6 10.36,25.6 10.06,25.3 10.06,22.86 7.77,22.86 5.18,25.45 J4.P$1
N$15
  Bottom 0.152: 21.03,15.24 21.03,18.9 IC4.2 | R35.2 21.03,2.59 21.03,4.12 19.51,5.64 C16.1 19.51,5.79 19.51,8.84 R28.2 19.51,8.99 19.51,12.04 R34.2 19.51,12.19 21.03,13.72 21.03,15.24 | 21.03,15.24 R33.1
N$16  (via drill 0.3)
  Top 0.152: v19.51,4.72 19.51,19.66 v21.95,22.1 | v21.95,33.07 21.95,33.38 17.07,38.25 13.56,38.25 4.88,46.94 4.88,47.85 5.49,48.46 7.32,48.46 8.38,47.4 R46.P$2
  Bottom 0.152: v19.51,4.72 19.51,2.59 R35.1 | v21.95,22.1 22.86,23.01 22.86,32.16 v21.95,33.07
N$17
  Bottom 0.152: R34.1 21.18,12.04 21.18,10.36 22.55,8.99 22.55,1.52 22.1,1.07 6.71,1.07 5.18,2.59 J11.P$1
N$18
  Bottom 0.152: 19.51,41 19.51,43.13 R23.2 | 19.51,41 19.51,40.23 R18.2 | 19.51,37.03 19.51,34.14 R16.1 19.51,33.98 19.51,31.09 C12.1 19.51,30.94 20.27,30.18 20.27,27.28 19.81,26.82 19.81,24.23 IC4.6 | 19.51,41 21.79,41 21.95,40.84 21.95,39.47 19.51,37.03 | 19.51,37.03 R17.2
N$19  (via drill 0.3)
  Top 0.152: v32,63.09 32,75.89 31.24,76.66 R2.P$2
  Bottom 0.152: v32,63.09 28.35,63.09 27.28,62.03 24.69,62.03 22.86,60.2 22.86,56.54 18.44,52.12 17.22,52.12 16.92,51.82 16.92,49.68 22.55,44.04 22.55,39.62 21.18,38.25 21.18,37.19 R17.1
N$20
  Bottom 0.152: R18.1 21.03,40.08 20.27,39.32 15.09,39.32 J5.P$1
N$21
  Bottom 0.152: R36.1 29.72,2.59 29.72,5.64 C17.1 29.72,5.79 29.72,8.84 R29.2 29.72,8.99 29.72,12.04 R38.2 29.72,12.19 29.72,15.24 | 29.72,15.24 31.09,16.61 31.09,18.9 IC5.2 | 29.72,15.24 R37.2
N$22
  Bottom 0.152: R38.1 31.39,12.04 31.39,10.21 32.16,9.45 32.16,7.92 30.48,6.25 30.48,1.98 30.79,1.68 31.85,1.68 38.86,8.69 38.86,54.25 31.24,61.87 R5.P$2
N$23  (via drill 0.3)
  Top 0.152: v28.04,28.8 28.04,37.19 25.91,39.32 25.15,39.32 J6.P$1
  Bottom 0.152: v28.04,28.8 28.04,28.04 29.11,26.98 29.11,23.16 31.7,20.57 31.7,17.83 31.39,17.53 31.39,15.24 R37.1
N$24
  Bottom 0.152: R21.2 29.72,43.13 29.72,40.23 R20.2 29.72,40.08 29.72,37.19 R19.1 29.72,37.03 29.72,34.14 C14.1 29.72,33.98 29.72,31.09 R24.2 29.72,30.94 30.48,30.18 30.48,27.28 29.87,26.67 29.87,24.23 IC5.6
N$25
  Bottom 0.152: R20.1 31.24,40.23 31.24,41.76 30.48,42.52 30.48,46.48 31.24,47.24 R26.P$2
N$26
  Bottom 0.152: R21.1 31.39,43.13 35.05,39.47 J7.P$1
N$27
  Bottom 0.152: R45.1 22.4,68.73 22.4,66.9 23.47,65.84 23.47,65.38 IC6.15
N$28
  Bottom 0.152: R44.1 25.3,51.97 25.3,53.34 24.84,53.8 24.84,59.13 IC6.1
N$29
  Bottom 0.152: 10.97,15.24 10.97,18.75 10.82,18.9 IC3.2 | R32.2 10.97,2.59 10.97,4.12 9.45,5.64 C15.1 9.3,5.79 9.3,8.84 R27.2 9.3,8.99 9.3,12.04 R31.2 9.45,12.19 9.45,12.65 10.97,14.17 10.97,15.24 | 10.97,15.24 R30.1
N$30
  Bottom 0.152: R43.1 21.64,53.03 21.64,54.86 23.47,56.69 23.47,59.13 IC6.2
N$31
  Bottom 0.152: R49.1 17.83,53.03 17.83,54.25 22.1,58.52 22.1,59.13 IC6.3
N$32
  Bottom 0.152: R48.1 14.02,51.51 14.02,51.82 20.88,58.67 20.88,59.13 IC6.4
N$33
  Bottom 0.152: R47.1 9.75,58.67 12.34,58.67 13.41,57.61 19.05,57.61 19.66,58.22 19.66,59.13 IC6.5
N$34  (via drill 0.3)
  Top 0.152: v24.08,63.86 8.69,63.86 7.01,62.18 7.01,61.72 6.25,60.96 4.27,60.96 2.59,62.64 2.29,62.64 1.83,62.18 1.83,29.57 4.72,26.67 10.67,26.67 12.04,25.3 14.78,25.3 14.94,25.45 J8.P$1
  Bottom 0.152: v24.08,63.86 24.08,68.73 R45.2
N$35
  Bottom 0.152: R44.2 25.45,50.14 25.45,48.01 25.76,47.7 25.76,44.65 24.84,43.74 24.84,41.91 23.32,40.39 23.32,27.28 24.99,25.6 J9.P$1
N$36
  Bottom 0.152: R43.2 21.64,51.21 24.69,51.21 24.84,51.05 32.77,51.05 33.07,51.36 34.75,51.36 38.56,47.55 38.56,29.11 35.05,25.6 J10.P$1
N$39
  Bottom 0.152: 9.6,71.93 9.6,70.56 C6.1 | 9.6,71.93 9.6,73.46 L1.2 | 9.6,71.93 14.17,71.93 14.48,72.24 14.48,73.76 15.39,74.68 16,74.68 IC1.18
RANDOM_GATE
  Bottom 0.152: IC6.7 17.22,59.28 17.22,59.89 19.96,62.64 26.98,62.64 28.35,64.01 35.51,64.01 38.56,60.96 JP1.3
REF_-5  (via drill 0.3)
  Top 0.152: v21.95,4.72 27.89,4.72 v30.33,7.16 30.33,8.69 33.83,12.19 34.75,12.19 37.95,15.39 37.95,26.52 35.51,28.96 | 35.51,28.96 33.53,30.94 v32.46,30.94 32.16,31.24 32.16,33.83 23.77,42.22 v21.95,42.22 | v35.51,74.68 35.51,71.63 37.49,69.65 37.49,66.6 37.34,66.45 37.34,55.17 37.95,54.56 37.95,31.39 35.51,28.96
  Bottom 0.152: R22.1 10.97,43.28 10.97,45.87 9.91,46.94 9.91,47.85 12.65,50.6 14.48,50.6 15.24,49.84 15.24,46.33 16.61,44.96 19.36,44.96 21.03,43.28 R23.1 21.18,43.13 21.95,42.37 v21.95,42.22 | C8.1 21.34,98.3 21.34,101.35 IC2.2 21.49,101.5 22.25,102.26 23.77,102.26 28.04,106.53 R8.2 28.19,106.53 28.8,106.53 32,103.33 34.44,103.33 35.36,102.41 35.36,99.21 34.29,98.15 34.29,84.89 33.83,84.43 33.83,78.49 35.51,76.81 v35.51,74.68 | 22.25,4.72 22.25,7.77 21.18,8.84 R28.1 | 22.25,4.72 22.25,1.68 21.95,1.37 14.78,1.37 13.56,2.59 13.56,5.33 11.12,7.77 11.12,8.84 R27.1 | v30.33,7.16 31.24,8.08 31.24,8.84 R29.1 | 22.25,4.72 v21.95,4.72 | v32.46,30.94 31.39,30.94 R24.1
RESET
  Bottom 0.152: IC1.29 20.73,81.53 21.18,81.99 21.18,84.58 R3.1 21.18,84.73 21.18,85.8 18.59,88.39 J15.5
RND_CV  (via drill 0.3)
  Top 0.152: v16.76,80.92 8.23,80.92 1.22,73.91 1.22,18.59 4.12,15.7 v17.37,15.7
  Bottom 0.152: 18.59,14.48 18.59,1.98 18.9,1.68 21.79,1.68 21.95,1.83 21.95,3.66 21.18,4.42 21.18,5.64 C16.2 | 18.59,14.48 19.36,15.24 R33.2 19.51,15.24 20.27,16 20.27,20.12 20.57,20.42 21.34,20.42 22.1,19.66 22.1,19.05 IC4.1 | v16.76,80.92 17.37,80.92 IC1.25 | 18.59,14.48 v17.37,15.7
SCK  (via drill 0.3)
  Top 0.152: v17.53,79.86 17.53,84.89 21.03,88.39 J15.3 | v18.29,68.12 18.29,73.61 v17.22,74.68
  Bottom 0.152: v17.53,79.86 17.53,74.98 v17.22,74.68 16.61,74.07 16.15,74.07 IC1.17 | v18.29,68.12 18.29,65.38 IC6.11
SS
  Bottom 0.152: IC1.14 19.2,72.39 19.2,69.95 19.66,69.49 19.66,65.38 IC6.12
SW_RESET  (via drill 0.3)
  Top 0.152: v26.67,81.69 27.43,81.69 36.88,91.14 36.88,102.11 SW1.1 36.88,102.26 36.88,107.29 SW1.2
  Bottom 0.152: v26.67,81.69 24.69,79.7 IC1.1
TEMPO
  Bottom 0.152: IC1.19 16.15,75.59 16.61,75.59 16.92,75.89 16.92,80.01 15.7,81.23 15.7,87.33 15.24,87.78 13.26,87.78 12.8,88.24 12.8,91.9 13.11,92.2 16,92.2 17.68,93.88 20.57,93.88 21.95,95.25 R1.P$2
VCC  (via drill 0.3)
  Top 0.152: v17.22,92.66 16,92.66 v11.58,88.24
  Bottom 0.152: v17.22,92.66 24.23,92.66 24.38,92.51 26.06,92.51 D2.C | v11.58,88.24 10.67,88.24 10.06,87.63 IC7.3 9.91,87.63 4.88,92.66 4.88,96.93 C19.+
VEE
  Top 0.152: U$1.V-- 38.41,95.71 38.41,97.99 U$1.V-
  Bottom 0.152: R8.1 26.52,106.68 26.82,106.68 27.58,107.44 30.18,107.44 32,105.61 32.61,105.61 35.81,102.41 35.81,100.58 38.25,98.15 U$1.V-
X_CV  (via drill 0.3)
  Top 0.152: v6.55,75.59 v11.58,75.59
  Bottom 0.152: IC3.1 12.19,18.9 12.19,11.73 10.21,9.75 10.21,8.23 10.97,7.47 10.97,5.79 C15.2 11.12,5.64 11.89,4.88 11.89,1.98 11.58,1.68 8.69,1.68 8.38,1.98 8.38,12.65 9.3,13.56 9.3,15.24 R30.2 9.45,15.24 10.06,15.85 10.06,20.27 9.91,20.42 7.32,20.42 1.52,26.21 1.52,70.26 6.55,75.29 v6.55,75.59 | v11.58,75.59 14.63,78.64 16,78.64 IC1.23
Y_CV  (via drill 0.3)
  Top 0.152: v2.44,62.03 2.44,55.32 2.13,55.02 2.13,43.89 v10.97,35.05 10.97,32.77 v12.5,31.24
  Bottom 0.152: C10.2 10.97,31.09 10.97,33.98 R13.2 10.97,34.14 v10.97,35.05 | v2.44,62.03 5.79,65.38 5.79,72.39 9.45,76.05 9.45,76.66 12.34,79.55 16,79.55 IC1.24 | v12.5,31.24 12.5,27.13 10.82,25.45 10.82,24.23 IC3.7

### Text on the board
bNames: CC-BY-SA-3.0 | Original design by Olivier Gillet | | | Mod by Codex Modulex - 2018 - v4.0